# Altium project mulipage.PrjPcb
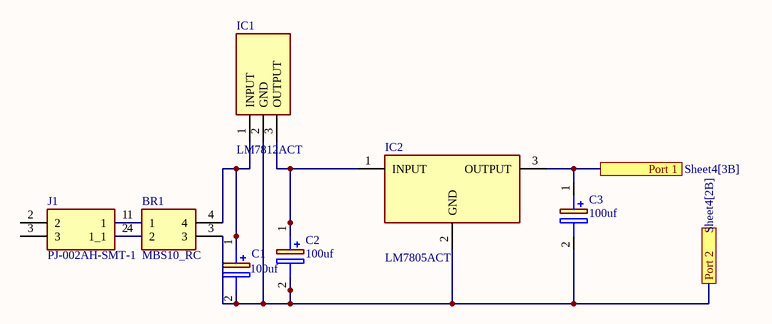
[diagram p0: Sheet3.SchDoc]
2 sheets, 8 parts. Net scope: flat (ports and power ports of the same name join across sheets).
Board file: PCB3.PcbDoc
Sheets:
  Sheet3.SchDoc
  Sheet4.SchDoc

## Sheet Sheet3.SchDoc
size A4; SheetNumber: 1; SheetTotal: 2

### Parts
BR1  MBS10_RC  [SOP240P690X290-4N]
C1  100uf  [CAPPRD500W65D1250H2700]
C2  100uf  [CAPPRD500W65D1250H2700]
C3  100uf  [CAPPRD500W65D1250H2700]
IC1  LM7812ACT  [TO254P470X1016X2019-3P]
IC2  LM7805ACT  [TO254P470X1016X2019-3P]
J1  PJ-002AH-SMT-1  [PJ002AHSMT1]

### Ports
Port 1 (see Sheet4[3B]), Port 2 (see Sheet4[2B])

### Nets
NetBR1_1: BR1.1 J1.1
NetBR1_2: BR1.2 J1.4(1_1)
NetBR1_3: BR1.3 C1.2(-) C2.2(-) C3.2(-) IC1.2(GND) IC2.2(GND) ; port Port 2
NetBR1_4: BR1.4 C1.1(+) IC1.1(INPUT)
NetC2_1: C2.1(+) IC1.3(OUTPUT) IC2.1(INPUT)
NetC3_1: C3.1(+) IC2.3(OUTPUT) ; port Port 1

Not connected (* = marked no-connect by the designer): J1 2 3

### Library data of the parts
BR1 = MBS10_RC: Bridge Rectifier; Manufacturer_Name: Taiwan Semiconductor; Manufacturer_Part_Number: MBS10 RC; Height: 2.9mm; Mouser Part Number: N/A; Mouser Price/Stock: https://www.mouser.com/Search/Refine.aspx?Keyword=N%2FA; Arrow Part Number: MBS10 RC; Arrow Price/Stock: https://www.arrow.com/en/products/mbs10rc/taiwan-semiconductor?region=nac
C1-C3 = EEUTA1E102LB: Capacitor Polarised; Manufacturer_Name: Panasonic; Datasheet Link: http://industrial.panasonic.com/cdbs/www-data/pdf/RDF0000/ABA0000C1212.pdf; Height: 27mm; Manufacturer_Part_Number: EEUTA1E102LB
IC1 = LM7812ACT: Integrated Circuit; Manufacturer_Name: onsemi; Datasheet Link: https://datasheet.datasheetarchive.com/originals/distributors/Datasheets_SAMA/704b005d7d2d9ced5864f40b6609c1bc.pdf; Height: 4.7mm; Manufacturer_Part_Number: LM7812ACT; Mouser Part Number: 512-LM7812ACT; Mouser Price/Stock: https://www.mouser.com/Search/Refine.aspx?Keyword=512-LM7812ACT; Arrow Part Number: LM7812ACT; Arrow Price/Stock: https://www.arrow.com/en/products/lm7812act/on-semiconductor
IC2 = LM7805ACT: Integrated Circuit; Manufacturer_Name: onsemi; Datasheet Link: https://componentsearchengine.com/Datasheets/2/LM7805ACT.pdf; Height: 4.7mm; Manufacturer_Part_Number: LM7805ACT; Mouser Part Number: 512-LM7805ACT; Mouser Price/Stock: https://www.mouser.co.uk/ProductDetail/ON-Semiconductor-Fairchild/LM7805ACT?qs=VOMQJJE%252BBNlQknJDd4ZVLg%3D%3D; Arrow Part Number: LM7805ACT; Arrow Price/Stock: https://www.arrow.com/en/products/lm7805act/on-semiconductor
J1 = PJ-002AH-SMT-1: Connector; Manufacturer_Name: CUI Devices; Datasheet Link: https://www.cui.com/product/resource/pj-002ah-smt-tr.pdf; Height: 11mm; Manufacturer_Part_Number: PJ-002AH-SMT-1; Mouser Part Number: N/A; Mouser Price/Stock: https://www.mouser.co.uk/ProductDetail/CUI-Inc/PJ-002AH-SMT-1/?qs=WyjlAZoYn53v8l9vpJCO1Q%3D%3D

## Sheet Sheet4.SchDoc
size A4; SheetNumber: 2; SheetTotal: 2
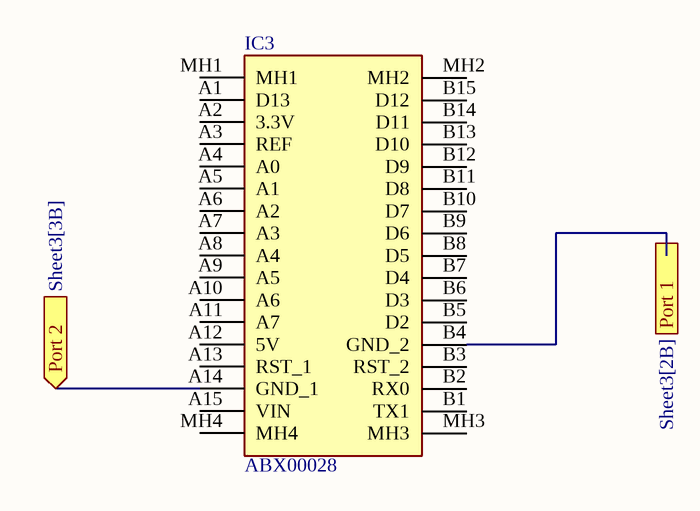
[diagram p1: Sheet4.SchDoc]

### Parts
IC3  ABX00028  [ABX00028]

### Ports
Port 1 (out, see Sheet3[2B]), Port 2 (in, see Sheet3[3B])

### Nets
NetBR1_3: IC3.A14(GND_1) ; port Port 2
NetC3_1: IC3.B4(GND_2) ; port Port 1

Not connected (* = marked no-connect by the designer): IC3 A1(D13) A2(3.3V) A3(REF) A4(A0) A5(A1) A6(A2) A7(A3) A8(A4) A9(A5) A10(A6) A11(A7) A12(5V) A13(RST_1) A15(VIN) B1(TX1) B2(RX0) B3(RST_2) B5(D2) B6(D3) B7(D4) B8(D5) B9(D6) B10(D7) B11(D8) B12(D9) B13(D10) B14(D11) B15(D12) MH1 MH2 MH3 MH4

### Library data of the parts
IC3 = ABX00028: Integrated Circuit; Manufacturer_Name: Arduino; Datasheet Link: https://store.arduino.cc/arduino-nano-every; Height: 10mm; Manufacturer_Part_Number: ABX00028; Mouser Part Number: 782-ABX00028; Mouser Price/Stock: https://www.mouser.co.uk/ProductDetail/Arduino/ABX00028?qs=PzGy0jfpSMtit6rnFl8mVg%3D%3D; Arrow Part Number: ABX00028; Arrow Price/Stock: https://www.arrow.com/en/products/abx00028/arduino-corporation?region=nac

## Nets that join several sheets
NetBR1_3: Sheet3 (6 pins), Sheet4 (IC3.A14)
NetC3_1: Sheet3 (C3.1 IC2.3), Sheet4 (IC3.B4)